# EAGLE design etapa 5 (EAGLE 7.5.0)
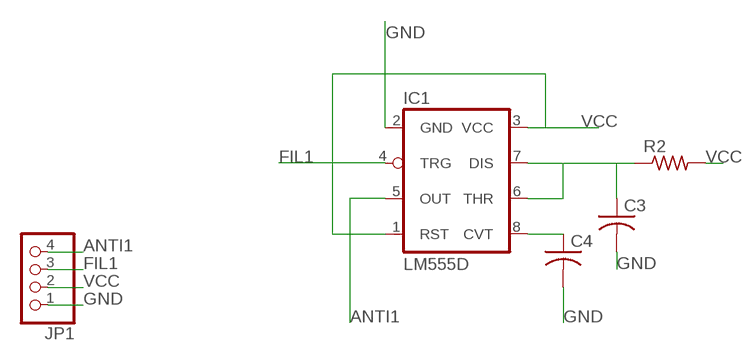
[diagram p0: schematic, sheet 1]

## Parts
C3  C-USC0603  [C0603]
C4  C-USC0603  [C0603]
IC1  LM555D  [SO08]
JP1  PINHD-1X4  [1X04]
R2  R-US_R0603  [R0603]

## Nets
ANTI1: IC1.5(OUT) JP1.4
FIL1: IC1.4(TRG) JP1.3
GND: C3.2 C4.2 IC1.2(GND) JP1.1
N$9: C4.1 IC1.8(CVT)
N$10: C3.1 IC1.6(THR) IC1.7(DIS) R2.1
VCC: IC1.1(RST) IC1.3(VCC) JP1.2 R2.2

## Library data of the parts
C3 C4 = rcl:C-US: CAPACITOR, American symbol
IC1 = linear:*555: TIMER
JP1 = pinhead:PINHD-1X4: PIN HEADER
R2 = rcl:R-US_: RESISTOR, American symbol

## Board
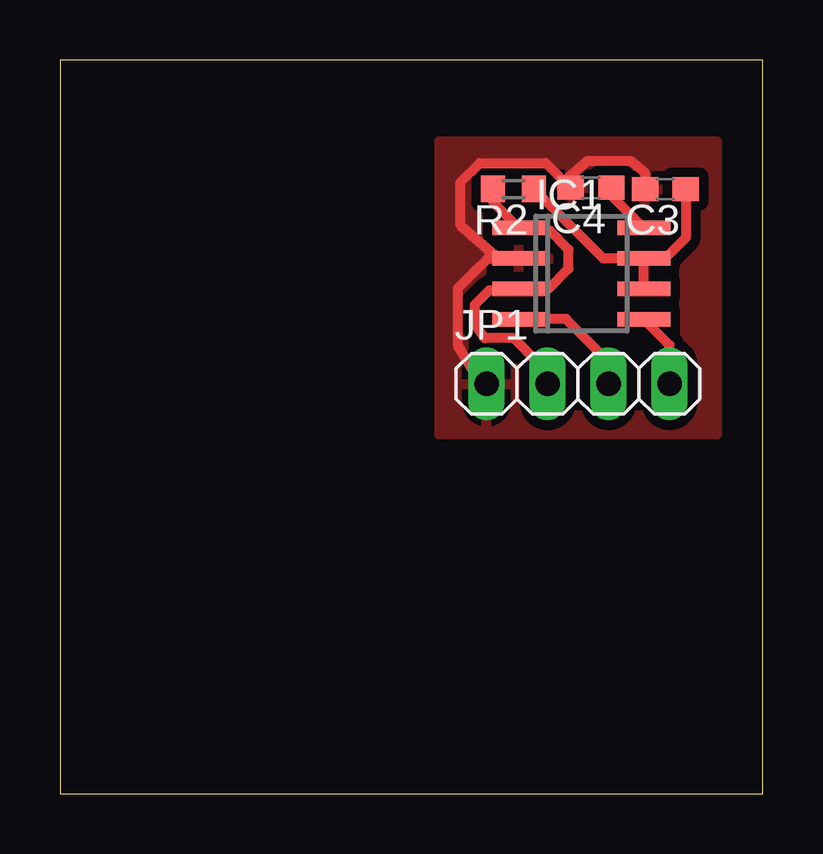
[diagram p1: board, top side]

Size 29.3 x 30.6 mm. Coordinates in mm from the lower left corner, seen from the top.
Outline: 0,0 29.3,0 29.3,30.6 0,30.6 0,0
Copper layers (1*16): Top 0.035mm / dielectric 1.5mm / Bottom 0.035mm
Design rules "default": minimum track width 10mil, minimum drill 24mil, track to track 8mil, track to pad 8mil, pad to pad 8mil, via to via 8mil, smd to smd 8mil, copper to edge 40mil, drill to drill 8mil, minimum pad ring 10mil, minimum via ring 8mil, stop-mask expansion 4mil, vias tented up to drill 0mil, thermal gap 10mil

### Footprints (pad centres in the part's own frame; a part is rotated, then mirrored left to right if it is on the bottom)
C0603 = smd 1.1 x 1: 1 -0.85,0; 2 0.85,0
SO08 = smd 0.6 x 2.2: 1 -1.905,-2.6; 2 -0.635,-2.6; 3 0.635,-2.6; 4 1.905,-2.6; 5 1.905,2.6; 6 0.635,2.6; 7 -0.635,2.6; 8 -1.905,2.6
1X04 = drill 1.016 long: 1 -3.81,0; 2 -1.27,0; 3 1.27,0; 4 3.81,0
R0603 = smd 1 x 1.1: 1 -0.85,0; 2 0.85,0

### Placement (x,y rotation side)
C3  25.24,25.22 180 top
C4  22.14,25.27 180 top
IC1  21.74,21.69 270 top
JP1  21.6,17.1 0 top
R2  18.91,25.22 180 top

### Tracks (layer width: path | path; a pad name or v marks a point on that pad's centre or on a via)
ANTI1
  Top 0.406: JP1.4 25.41,18.71 IC1.5
FIL1
  Top 0.406: JP1.3 22.87,18.03 21.1,19.8 19.16,19.8 IC1.4
GND
  Top 0.406: C3.2 24.4,25.9 23.8,26.4 22,26.4 21.19,25.69 C4.2 20.26,26.3 17.5,26.3 16.7,25.5 16.7,23.7 18.27,22.32 IC1.2 17.82,22.3 17.3,21.8 16.6,21.1 16.6,18.7 17.5,17.2 JP1.1
  pour Top (isolate 0.406): 15.8,15 27.4,15 27.4,27.2 15.8,27.2
N$9
  Top 0.406: C4.1 22.89,25.05 IC1.8
N$10
  Top 0.406: C3.1 26.09,23.19 25.2,22.3 24.36,22.3 IC1.7 | IC1.6 IC1.7 | IC1.7 22.66,22.32 R2.1
VCC
  Top 0.406: R2.2 18.06,24.68 IC1.1 19.23,23.5 20.4,23.5 21.2,22.7 21.2,21.9 20.36,21.05 IC1.3 19.09,21 17.9,21 17.3,20.4 17.3,19.6 17.7,19 18.9,19 20.33,17.57 JP1.2